# EAGLE design GBP USB-C Charging Kit Pro (EAGLE 6.2)
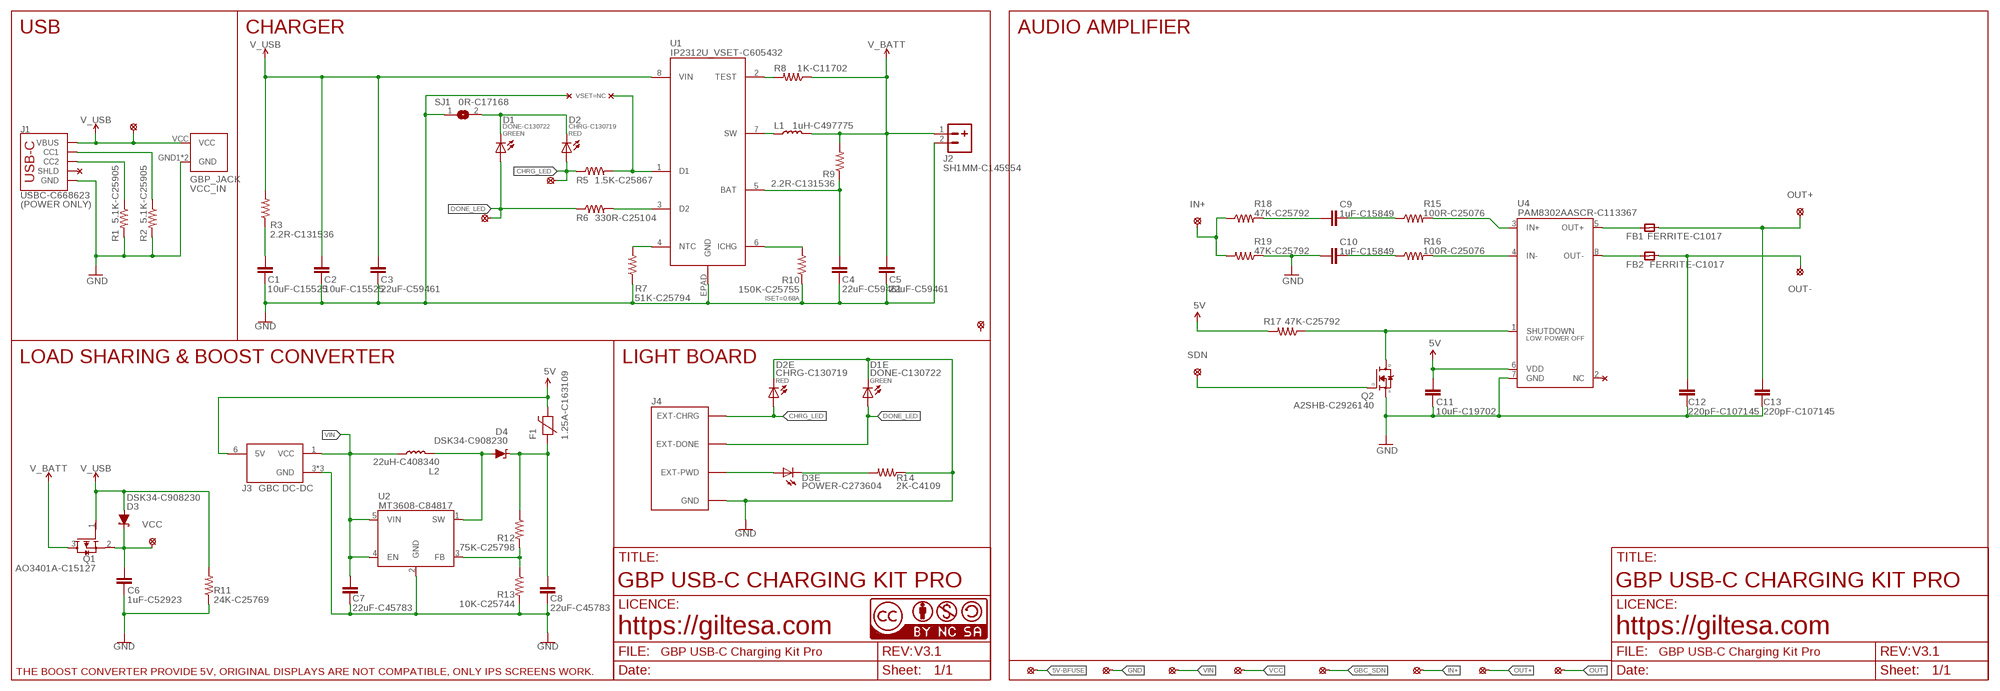
[diagram p0: schematic, sheet 1]

## Parts
C1  10uF-C15525  C0402_S  [C0402_S]
C2  10uF-C15525  C0402_S  [C0402_S]
C3  22uF-C59461  C0603_SMALL  [C0603_S]
C4  22uF-C59461  C0603_SMALL  [C0603_S]
C5  22uF-C59461  C0603_SMALL  [C0603_S]
C6  1uF-C52923  C0402_S  [C0402_S]
C7  22uF-C45783  C0805_SMALL  [C0805_S]
C8  22uF-C45783  C0805_SMALL  [C0805_S]
C9  1uF-C15849  C0603_SMALL  [C0603_S]
C10  1uF-C15849  C0603_SMALL  [C0603_S]
C11  10uF-C19702  C0603_SMALL  [C0603_S]
C12  220pF-C107145  C0805_SMALL  [C0805_S]
C13  220pF-C107145  C0805_SMALL  [C0805_S]
D1  DONE-C130722  LED_0402  [L0402]
D1E  DONE-C130722  LED_0402  [L0402]
D2  CHRG-C130719  LED_0402  [L0402]
D2E  CHRG-C130719  LED_0402  [L0402]
D3  DSK34-C908230  DIODE-SCHOTTKY_SOD-123FL  [SOD-123FL]
D3E  POWER-C273604  LED_0402  [L0402]
D4  DSK34-C908230  DIODE-SCHOTTKY_SOD-123FL  [SOD-123FL]
F1  1.25A-C163109  FUSE0603_S  [F0603_S]
FB1  FERRITE-C1017  MICROBUILDER_FERRITE_SMALL  [MICROBUILDER__0805MP_S]
FB2  FERRITE-C1017  MICROBUILDER_FERRITE_SMALL  [MICROBUILDER__0805MP_S]
GBP_JACK  VCC_IN  GBP_POWER_JACK_DIP  [GBP_POWER_JACK_DIP]
J1  USBC-C668623  USB-C_6P_POWER  [USB-C_6P]
J2  SH1MM-C145954  JST-21MM  [JST-2-1MM-SMD_RIGHT]
J3  GBC DC-DC  GBP_DC_DC_V2  [GBP_DC_DC_DIP_V2]
J4  GBP_LED_V2  [GBP_LED_V2]
L1  1uH-C497775  INDUCTOR_2  [PSPMAA0402]
L2  22uH-C408340  INDUCTOR_2  [PSPMAA0402]
PP1  SOLDER_PAD-1.5  [SOLDER_PAD_1.5]
PP2  SOLDER_PAD-1.5  [SOLDER_PAD_1.5]
PP3  SOLDER_PAD-1.5  [SOLDER_PAD_1.5]
PP4  SOLDER_PAD-1.5  [SOLDER_PAD_1.5]
PP5  SOLDER_PAD-1.5  [SOLDER_PAD_1.5]
PP6  SOLDER_PAD-1.5  [SOLDER_PAD_1.5]
PP7  SOLDER_PAD-1.5  [SOLDER_PAD_1.5]
PP8  SOLDER_PAD-1.5  [SOLDER_PAD_1.5]
Q1  AO3401A-C15127  AO3401A_SMALL  [SOT23-3_S]
Q2  A2SHB-C2926140  MOSFET-NCHANNEL_SMALL  [SOT23-3_S]
R1  5.1K-C25905  R0402  [R0402]
R2  5.1K-C25905  R0402  [R0402]
R3  2.2R-C131536  R0402  [R0402]
R5  1.5K-C25867  R0402  [R0402]
R6  330R-C25104  R0402  [R0402]
R7  51K-C25794  R0402  [R0402]
R8  1K-C11702  R0402  [R0402]
R9  2.2R-C131536  R0402  [R0402]
R10  150K-C25755  R0402  [R0402]
R11  24K-C25769  R0402  [R0402]
R12  75K-C25798  R0402  [R0402]
R13  10K-C25744  R0402  [R0402]
R14  2K-C4109  R0402  [R0402]
R15  100R-C25076  R0402  [R0402]
R16  100R-C25076  R0402  [R0402]
R17  47K-C25792  R0402  [R0402]
R18  47K-C25792  R0402  [R0402]
R19  47K-C25792  R0402  [R0402]
SJ1  0R-C17168  JUMPER-SMD0402  [JUMPER-SMD_0402]
U1  IP2312U_VSET-C605432  IP2312_CUSTOM  [IP2312]
U2  MT3608-C84817  MT3608"  [SOT-23-6]
U4  PAM8302AASCR-C113367  PAM8302A_ASCR  [PAM8302AASCR]
U$1  VCC  PAD_1.4  [PAD_1.4]
U$2  SDN  PAD_1.25  [PAD_1.25]
U$6  CC-BY-NC-SA15MM  [CC-BY-NC-SA_15MM]
U$20  OUT+  SOLDER_PAD-2.0  [SOLDER_PAD_2.0]
U$23  OUT-  SOLDER_PAD-2.0  [SOLDER_PAD_2.0]
U$24  CHRG_LED  SOLDER_PAD-1.3  [SOLDER_PAD_1.3]
U$25  DONE_LED  SOLDER_PAD-1.3  [SOLDER_PAD_1.3]
U$30  IN+  SOLDER_PAD-1.3  [SOLDER_PAD_1.3]
U$54  PAD_1.4  [PAD_1.4]
U$55  SOLDER_PAD-2.0  [SOLDER_PAD_2.0]

## Nets
5V: C11.1 F1.2 J3.6(5V) R17.2 U4.6(VDD)
5V-BFUSE: C8.2 D4.C F1.1 PP1.P$1 R12.1
CHRG_LED: D2.A D2E.A J4.EXT-CHRG R5.1 U$24.P$1
DONE_LED: D1.A D1E.A J4.EXT-DONE R6.1 U$25.P$1
GBC_SDN: PP5.P$1 Q2.1(G) U$2.P$1
GND: C1.1 C2.1 C3.1 C4.1 C5.1 C6.2 C7.1 C8.1 C10.2 C11.2 C12.2 C13.2 D1E.C D2E.C GBP_JACK.GND1(GND) GBP_JACK.GND2(GND) J1.A12-GND(GND) J1.B12-GND(GND) J2.2 J3.3(GND) J3.3_1(GND) J3.3_2(GND) J4.GND PP2.P$1 Q2.2(S) R1.2 R2.2 R7.1 R10.1 R11.1 R13.2 R14.1 R19.1 SJ1.1 U1.EPAD(GND) U2.2(GND) U4.7(GND)
IN+: PP6.P$1 R18.1 R19.2 U$30.P$1
N$1: D1.C D2.C SJ1.2
N$3: D4.A L2.P$2 U2.1(SW)
N$4: J1.B5(CC2) R1.1
N$6: R8.2 U1.2(TEST)
N$7: R12.2 R13.1 U2.3(FB)
N$9: R16.2 U4.4(IN-)
N$10: D3E.A J4.EXT-PWD J4.EXT-PWD'(EXT-PWD)
N$11: D3E.C R14.2
N$12: R15.2 U4.3(IN+)
N$13: J1.A5(CC1) R2.1
N$14: C4.2 R9.1 U1.5(BAT)
N$15: C1.2 R3.1
N$16: C10.1 R16.1
N$17: FB2.1 U4.8(OUT-)
N$19: R5.2 U1.1(D1)
N$22: FB1.1 U4.5(OUT+)
N$23: C9.1 R15.1
N$25: C9.2 R18.2
N$27: R7.2 U1.4(NTC)
N$28: R10.2 U1.6(ICHG)
N$29: R6.2 U1.3(D2)
N$31: L1.P$1 U1.7(SW)
OUT+: C13.1 FB1.2 PP7.P$1 U$20.P$1
OUT-: C12.1 FB2.2 PP8.P$1 U$23.P$1
SDN: Q2.3(D) R17.1 U4.1(SHUTDOWN)
V_BATT: C5.2 J2.1 L1.P$2 Q1.3(D) R8.1 R9.2
V_USB: C2.2 C3.2 D3.A GBP_JACK.VCC J1.A9-VBUS(VBUS) J1.B9-VBUS(VBUS) Q1.1(G) R3.2 R11.2 U1.8(VIN) U$54.P$1
VCC: C6.1 D3.C PP4.P$1 Q1.2(S) U$1.P$1
VIN: C7.2 J3.1(VCC) L2.P$1 PP3.P$1 U2.4(EN) U2.5(VIN)
Unconnected: J1.SHLD1(SHLD) J1.SHLD2(SHLD) J1.SHLD3(SHLD) J1.SHLD4(SHLD) U4.2(NC) U$55.P$1

## Notes on the sheet
- USB | CHARGER | AUDIO AMPLIFIER
- VSET=NC
- GREEN | RED
- (POWER ONLY)
- ISET=0.68A
- LOAD SHARING & BOOST CONVERTER | LIGHT BOARD
- RED | GREEN
- GBP USB-C CHARGING KIT PRO | GBP USB-C CHARGING KIT PRO
- https://giltesa.com | https://giltesa.com
- V3.1 | V3.1
- THE BOOST CONVERTER PROVIDE 5V, ORIGINAL DISPLAYS ARE NOT COMPATIBLE, ONLY IPS SCREENS WORK.

## Library data of the parts
C1 C2 C6 = ,giltesa:C0402
C3-C5 C9-C11 = ,giltesa:C0603
C7 C8 C12 C13 = ,giltesa:C0805
D1 D1E D2 D2E D3E = ,giltesa:LED
D3 D4 = ,giltesa:DIODE-SCHOTTKY
F1 = ,giltesa:FUSE
FB1 FB2 = microbuilder:MICROBUILDER_FERRITE: Ferrite Bead 0603 MMZ1608B121C - 120 Ohm @ 100MHz, 600mA, 0.15 Ohm DC Resistance - Digikey: 445-2164-1-ND BK1608HW121-T - 120 Ohm, 600mA Ferrite Chip - Digikey: 587-1876-2-ND 0805 HZ0805B272R-10 - 2.7K Ohm @ 100MHz, 200mA, 0.8 Ohm DC Resistance - Digikey: 240-2504-1-ND (see also Murata BLM21BD272SN1L) MMZ2012Y152B - 1.5K Ohm @ 100MHz, 500mA, 0.4 Ohm DC Resistance - Digikey: 445-1560-1-ND - Mainly for high frequency (80-400MHz) MMZ2012R102A - 1K Ohm @ 100MHz, 500mA, 0.3 Ohm DC Resistance - Digikey: 445-1555-2-ND - More general purpose (10-200MHz)
GBP_JACK = ,giltesa:GBP_POWER_JACK
J1 = ,giltesa:USB-C_6P
J2 = ,giltesa:JST-2
J3 = ,giltesa:GBP_DC_DC
J4 = ,giltesa:GBP_LED_V2
L1 L2 = ,giltesa:INDUCTOR
PP1-PP8 U$20 U$23-U$25 U$30 U$55 = ,giltesa:SOLDER_PAD
Q1 = ,giltesa:AO3401A
Q2 = ,giltesa:MOSFET-NCHANNEL
R1-R3 R5-R19 = ,giltesa:R0402
SJ1 = ,giltesa:JUMPER-SMD
U1 = ,giltesa:IP2312
U2 = ,giltesa:MT3608
U4 = ,giltesa:PAM8302A
U$1 U$2 U$54 = ,giltesa:PAD
U$6 = ,giltesa_logos:CC-BY-NC-SA

## Net classes
1 power: width 0.61 mm, drill 0.406 mm, clearance 0.203 mm
2 gnd: width 0.305 mm, drill 0.406 mm, clearance 0.203 mm
3 power usb: width 0.508 mm, drill 0.406 mm, clearance 0.203 mm

## Board
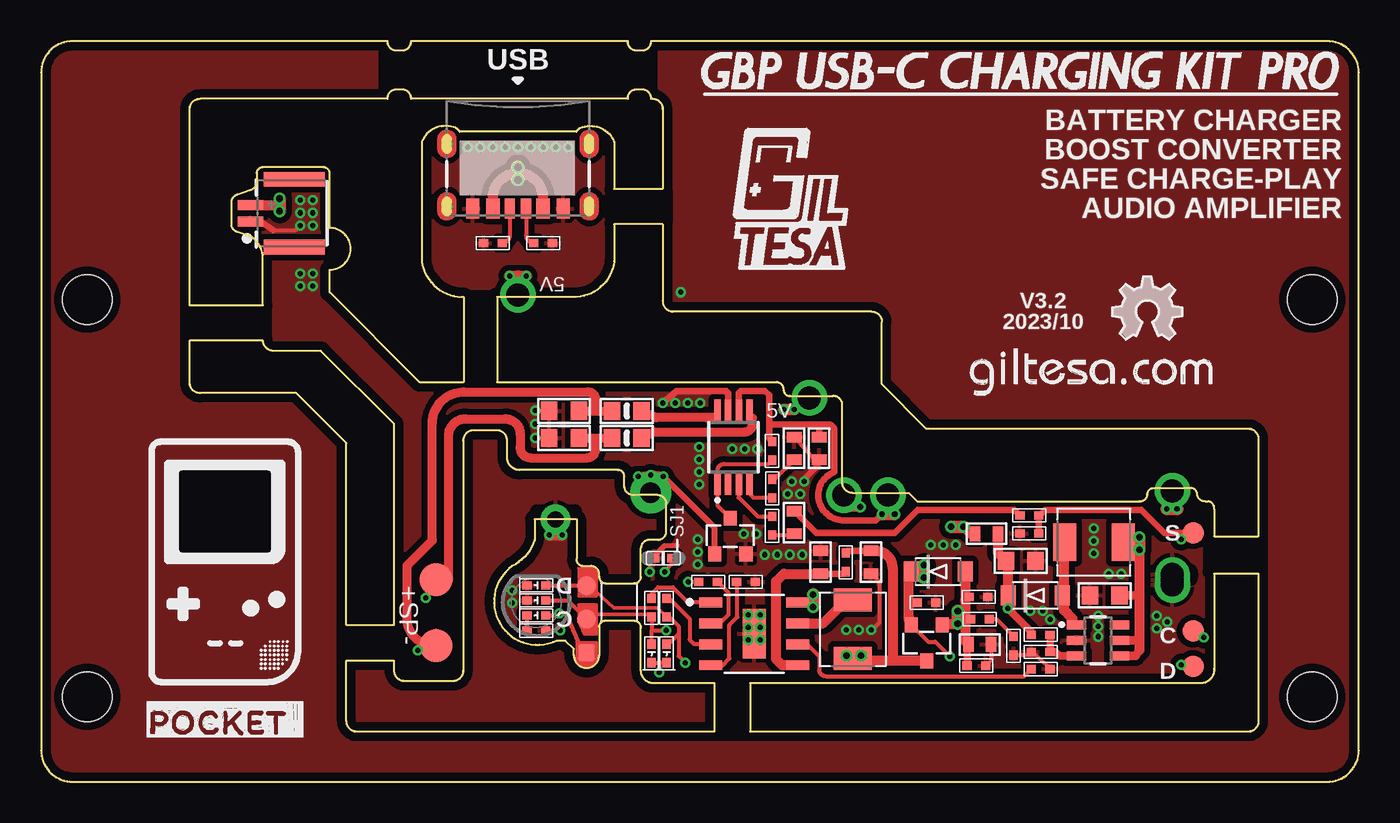
[diagram p1: board, top side]
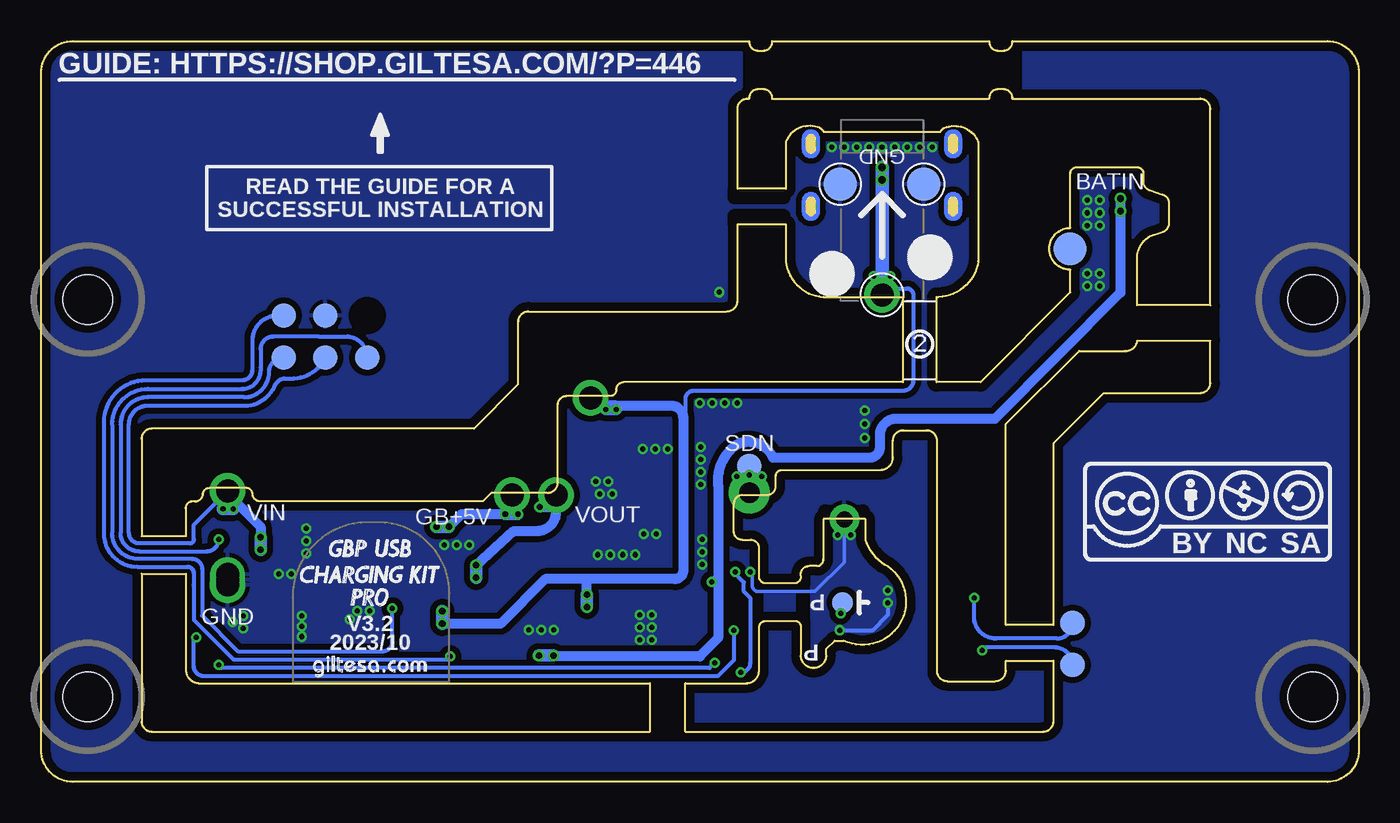
[diagram p2: board, bottom side, seen from below]

Size 80 x 45 mm. Coordinates in mm from the lower left corner, seen from the top.
Outline: 16.99,26.18 14.19,26.18 arc-90 13.46,26.79 9.01,26.79 9.01,24.25 arc90 9.64,23.62 15.49,23.62 18.54,20.57 18.54,9.52 21.43,9.52 21.43,21.74 16.99,26.18
Outline: 22.95,24.28 17.52,29.74 17.52,31.11 arc180 17.52,33.65 17.52,36.95 arc90 17.14,37.33 13.46,37.33 arc90 13.07,36.95 13.07,36.32 arc-50 12.69,35.94 11.93,35.68 arc60 11.55,35.3 11.55,33.78 arc60 11.93,33.4 12.69,33.14 arc-50 13.46,32 13.46,28.95 9.01,28.95 9.01,40.86 arc-90 9.64,41.5 21.03,41.5 arc-90 21.55,42.08 21.93,42.08 arc-90 22.44,41.5 35.62,41.5 arc-90 36.12,42.08 36.51,42.08 arc-90 37.01,41.5 37.13,41.5 arc-90 37.74,40.86 37.74,36.03 34.79,36.03 34.79,38.89 arc90 32.74,39.73 arc40 32.49,39.49 25.4,39.49 arc40 25.16,39.73 arc90 23.11,38.89 23.11,31.61 arc80 25.52,29.46 25.65,29.46 25.65,24.28 22.95,24.28
Outline: 53.18,17.04 66.66,17.04 arc90 67.17,17.47 arc-90 67.55,17.85 69.8,17.85 arc-90 70.18,17.47 arc90 70.69,17.04 70.85,17.04 arc-90 71.22,16.58 71.22,14.92 73.91,14.92 73.91,20.82 arc90 73.27,21.46 53.71,21.46 51.05,24.15 51.05,27.94 arc90 50.41,28.57 38.37,28.57 arc-90 37.74,29.21 37.74,33.88 34.79,33.88 34.79,31.61 arc-80 32.51,29.46 27.68,29.46 27.68,24.28 44.66,24.28 arc-90 45.08,23.8 arc90 45.45,23.44 48.08,23.44 arc-90 48.63,22.93 48.63,18.18 arc90 49.27,17.55 52.67,17.55 53.18,17.04
Outline: 71.22,12.63 71.22,6.88 arc-90 70.45,5.99 43.05,5.99 43.05,3.04 73.27,3.04 arc90 73.91,3.68 73.91,12.63 71.22,12.63
Outline: 40.89,5.99 37.18,5.99 arc-90 36.42,6.75 36.42,9.34 arc90 36.04,9.77 34.2,9.77 arc90 33.88,9.39 33.88,7.69 arc-180 32.34,7.69 32.34,8.07 31.83,8.57 31.27,8.57 arc-170 28.6,13.1 arc45 29.96,14.7 29.96,15.97 32.51,15.97 32.51,13.55 arc90 32.89,13.1 33.37,13.1 arc-90 33.88,12.66 33.88,12.51 arc90 34.25,12.05 35.98,12.05 arc90 36.42,12.45 36.42,14.19 arc-90 36.92,14.7 37.43,14.7 arc90 37.94,15.16 37.94,16.91 arc90 37.43,17.42 35.99,17.42 arc-90 35.4,17.93 35.4,18.56 arc90 35.02,18.94 29.05,18.94 arc-90 28.29,19.71 28.29,20.72 arc90 27.65,21.36 26.26,21.36 arc90 25.62,20.72 25.62,6.75 arc-90 24.99,6.12 22.07,6.12 arc-90 21.43,6.75 21.43,7.36 18.54,7.36 18.54,3.68 arc90 19.17,3.04 40.89,3.04 40.89,5.99
Outline: 1.91,0 78.07,0 arc90 80,1.91 80,43.1 arc90 78.07,45 37.01,45 arc-90 36.51,44.42 36.12,44.42 arc-90 35.62,45 22.44,45 arc-90 21.93,44.42 21.55,44.42 arc-90 21.03,45 1.91,45 arc90 0,43.1 0,1.91 arc90 1.91,0
Copper layers (1*16): Top 0.035mm / dielectric 1.6mm / Bottom 0.035mm
Design rules: minimum track width 6mil, minimum drill 12mil, track to track 6mil, track to pad 6mil, pad to pad 6mil, via to via 8mil, smd to smd 0mil, copper to edge 20mil, drill to drill 10mil, minimum pad ring 6mil, minimum via ring 6mil, stop-mask expansion 0mil, vias tented up to drill 100mil, thermal gap 10mil
Holes 3 mm at 77.17,29.29 2.8,29.29 2.8,5.16 77.17,5.16
tRestrict: area 8.6,14.1 to 13.7,18.7; 19 lines
bRestrict: area 59.6,27.7 to 60.8,29; 21 lines

### Footprints (pad centres in the part's own frame; a part is rotated, then mirrored left to right if it is on the bottom)
C0402_S = smd 0.559 x 0.5: 1 -0.567,0; 2 0.567,0
C0603_S = smd 0.635 x 0.9: 1 -0.694,0; 2 0.694,0
C0805_S = smd 1 x 1.1: 1 -0.901,0; 2 0.901,0
L0402 = smd 0.559 x 0.5: A 0.567,0; C -0.567,0
SOD-123FL = smd 0.91 x 1.22: A 1.637,0; C -1.637,0
F0603_S = smd 0.635 x 0.9: 1 -0.694,0; 2 0.694,0
MICROBUILDER__0805MP_S = smd 1 x 1.1: 1 -0.901,0; 2 0.901,0
GBP_POWER_JACK_DIP = smd 2.032 x 2.032 bottom: GND1 -2.54,1.905; GND2 2.54,1.905 | drill 1.397 pad 2.159: VCC 0,8.636
USB-C_6P = smd 0.635 x 1.2: A5 -0.5,2.034; B5 0.5,2.034 | smd 0.8 x 1.2: A9-VBUS 1.52,2.034; A12-GND 2.75,2.034; B9-VBUS -1.52,2.034; B12-GND -2.75,2.034 | drill 0.4 pad 0.6: SHLD1 -4.318,1.9; SHLD2 4.32,1.9; SHLD3 -4.318,-1.9; SHLD4 4.32,-1.9
JST-2-1MM-SMD_RIGHT = smd 0.6 x 1.524: 1 -0.5,-2.017; 2 0.5,-2.017 | smd 0.889 x 3.683: NC1 -2.054,0.635; NC2 2.054,0.635
GBP_DC_DC_DIP_V2 = drill 1.397 pad 2.159: 1 17.272,5.334; 3 17.272,-0.381; 6 0,5.08 | drill 1.397 pad 2.032: 3_1 17.272,-0.064; 3_2 17.272,0.254
GBP_LED_V2 = smd 1.143 x 1.143: EXT-CHRG -3.048,1.016; EXT-DONE -3.048,-1.016 | smd 1.27 x 1.27 bottom: EXT-PWD -1.27,0 | smd 1.016 x 1.016: EXT-PWD' -3.048,3.048 | drill 1 pad 1.8: GND -1.166,-5.048
PSPMAA0402 = smd 1.4 x 2.3: P$1 -1.775,0; P$2 1.775,0
SOLDER_PAD_1.5 = smd 1.5 x 1.5: P$1 0,0
SOT23-3_S = smd 0.8 x 0.9: 1 -0.95,-1.076; 2 0.95,-1.076; 3 0,1.1
R0402 = smd 0.559 x 0.5: 1 -0.567,0; 2 0.567,0
JUMPER-SMD_0402 = smd 0.635 x 0.5: 1 -0.559,0; 2 0.559,0
IP2312 = smd 1.4 x 0.6: 1 -2.65,1.905; 2 -2.65,0.635; 3 -2.65,-0.635; 4 -2.65,-1.905; 5 2.65,-1.905; 6 2.65,-0.635; 7 2.65,0.635; 8 2.65,1.905 | smd 1.4 x 3: EPAD 0,0
SOT-23-6 = smd 0.55 x 1.2: 1 -0.95,-1.3; 2 0,-1.3; 3 0.95,-1.3; 4 0.95,1.3; 5 0,1.3; 6 -0.95,1.3
PAM8302AASCR = smd 0.4 x 1.4: 1 -0.975,-2.2; 2 -0.325,-2.2; 3 0.325,-2.2; 4 0.975,-2.2; 5 0.975,2.2; 6 0.325,2.2; 7 -0.325,2.2; 8 -0.975,2.2
PAD_1.4 = drill 1.397 pad 2.159: P$1 0,0
PAD_1.25 = drill 1.25 pad 2.5: P$1 0,0
SOLDER_PAD_2.0 = smd 2 x 2: P$1 0,0
SOLDER_PAD_1.3 = smd 1.3 x 1.3: P$1 0,0

### Placement (x,y rotation side)
C1  59.03,8.27 90 top
C2  56.78,7.05 180 top
C3  56.99,8.35 180 top
C4  47.32,13.33 270 top
C5  50.38,13.33 90 top
C6  53.75,10.89 0 top
C7  64.58,11.32 0 top
C8  59.48,13.42 180 top
C9  45.71,15.76 90 top
C10  45.71,20.25 90 top
C11  47.24,20.25 270 top
C12  31.74,22.54 180 top
C13  31.74,20.89 180 top
D1  37.97,7.8 90 top
D1E  30.07,11.93 0 top
D2  37.06,7.8 90 top
D2E  30.07,11.02 0 top
D3  54.46,12.77 0 top
D3E  30.07,10.1 0 top
D4  60.36,11.32 0 top
F1  57.4,15.07 180 top
FB1  35.55,20.89 180 top
FB2  35.55,22.54 180 top
GBP_JACK  28.95,38.22 180 top
J1  28.95,36.86 180 top
J2  14.73,34.54 270 top
J3  51.4,12.34 0 top
J4  30.07,10.89 180 top
L1  49.28,9.26 270 top
L2  63.91,14.56 180 top
LOGO1  OSHW_LOGO_FILLX0150-NT  [OSHW_FILLX150_NOTEXT]  65.03,26.87 0 top
PP1  60.2,25.78 0 bottom
PP2  62.74,28.32 0 bottom
PP3  62.74,25.78 0 bottom
PP4  65.28,28.32 0 bottom
PP5  37,19.17 0 bottom
PP6  65.28,25.78 0 bottom
PP7  17.38,9.64 0 bottom
PP8  17.38,7.1 0 bottom
Q1  53.77,8.45 180 top
Q2  41.84,14.92 0 top
R1  27.43,32.73 180 top
R2  30.47,32.73 0 top
R3  56.99,9.89 180 top
R5  37.06,10.58 90 top
R6  37.97,10.58 90 top
R7  42.78,12.14 180 top
R8  40.5,12.14 0 top
R9  48.85,13.33 90 top
R10  60.68,6.85 180 top
R11  56.91,11.23 180 top
R12  60.68,8.93 0 top
R13  60.68,7.89 180 top
R14  30.07,9.19 180 top
R15  44.38,15.56 90 top
R16  44.38,17.82 270 top
R17  44.38,20.1 90 top
R18  59.99,16.18 180 top
R19  59.99,15.09 0 top
SJ1  37.77,13.58 0 top
U1  43.29,8.99 0 top
U2  64.16,8.59 270 top
U4  42.03,20.34 0 top
U$1  48.74,17.42 0 top
U$2  37,17.56 0 top
U$3  [GILTESA_LOGO_MASK_9MM]  41.15,30.99 0 top
U$4  [GBP_PRO_FRAME]  40.13,42.04 0 top
U$6  16.74,13.36 0 bottom
U$7  GILTESA.COM_MASK  [GILTESA.COM_MASK]  56.27,23.38 0 top
U$20  23.97,12.28 0 top
U$23  23.97,8.28 0 top
U$24  69.94,9.16 0 top
U$25  69.94,7 0 top
U$30  69.94,15.13 0 top
U$31  [GBP_FRAME_LOGO]  6.42,2.68 0 top
U$34  [GAME_BOY_POCKET_USB_CHARGING_KIT_PRO]  64.29,10.62 0 bottom
U$52  [GILTESA.COM_MASK_7MM]  63.53,6.3 0 bottom
U$54  46.64,23.33 0 top
U$55  17.53,32.38 0 bottom
U$61  [SCISSOR_TWO]  26.66,26.6 0 bottom

### Tracks (layer width: path | path; a pad name or v marks a point on that pad's centre or on a via)
5V  (via drill 0.36, 0.41)
  Top 0.406: U4.6 42.36,23.63 42.48,23.75 43.94,23.75 44.2,23.48 44.2,21.72 | C11.1 47.25,20.83 47.25,21.72 | v51.05,16.26 50.67,15.88 48.77,15.88 arc-90 47.18,17.4 arc-70 48.16,18.82 48.16,21.31 arc90 47.75,21.72 47.25,21.72 | v51.82,16.26 51.4,16.26 J3.6 | 47.25,21.72 44.2,21.72 | R17.2 44.2,20.86 44.2,21.72
  Top 0.61: F1.2 56.43,15.07 v56.01,15.49
  Top 0.711: v51.05,16.26 v51.82,16.26
  Top 0.762: v56.01,15.49 v55.24,15.49
  Bottom 0.61: v51.82,16.26 54.48,16.26 v55.24,15.49
  Bottom 0.711: v51.82,16.26 v51.05,16.26
  Bottom 0.762: v55.24,15.49 v56.01,15.49
5V-BFUSE  (via drill 0.3)
  Top 0.254: 60.07,8.93 R12.1
  Top 0.457: R12.1 60.12,9.1 58.93,10.29 | D4.C 58.79,11.19 58.93,11.05 58.93,10.29 | 58.93,10.29 v58.67,10.54
  Top 0.61: D4.C 58.72,13.27 C8.2 58.09,13.9 F1.1
  Bottom 0.254: PP1.P$1 PP1.P$1 arc-90 61.46,27.04 63.11,27.04 arc90 63.11,27.05 65.92,27.05 arc-90 66.67,26.29 66.67,25.15 66.67,25.02 arc90 67.81,23.87 73.53,23.87 arc-90 75.69,21.71 75.69,15.11 arc-90 74.15,13.55 70.85,13.55 arc90 70.23,12.95 70.23,10.1 68.07,7.94 59.24,7.94 arc-90 58.67,8.51 v58.67,10.54
CHRG_LED  (via drill 0.3)
  Top 0.203: R5.1 36.95,10.16 33.4,10.16 J4.EXT-CHRG
  Top 0.254: D2E.A 31.97,11.02 J4.EXT-CHRG 33.37,9.88 | D2.A 37.06,9.19 | 37.06,9.19 v37.95,9.19 | R5.1 37.06,9.19 | v70.6,8.78 U$24.P$1
  Bottom 0.254: v37.95,9.19 37.95,7.39 38.92,6.41 70.1,6.41 arc90 70.74,7.05 70.74,8.64 arc90 v70.6,8.78
DONE_LED  (via drill 0.3)
  Top 0.203: R6.1 37.4,10.58 34.77,10.58 33.37,11.85 J4.EXT-DONE
  Top 0.254: D1E.A 33.09,11.93 J4.EXT-DONE 33.12,11.72 | D1.A 38.09,8.37 38.71,8.99 | R6.1 38.15,10.01 38.71,9.45 38.71,8.99 | 38.71,8.99 38.71,7.64 v39.12,7.24 | v69.22,7.11 69.83,7.11 U$25.P$1
  Bottom 0.254: v39.12,7.24 39.43,6.92 69.09,6.92 69.22,7.05 v69.22,7.11
GBC_SDN  (via drill 0.3)
  Top 0.356: Q2.1 40.89,15.41 v37.77,18.54
  Top 0.559: v36.24,18.54 v37,18.64 | v37.77,18.54 v37,18.64 | v37,18.64 U$2.P$1
  Bottom 0.559: PP5.P$1 U$2.P$1
GND  (via drill 0.3)
  Top 0.203: v36.96,12.76 36.96,13.33 SJ1.1
  Top 0.254: R14.1 31.49,9.19 v31.51,9.21 | C11.2 47.1,19.43 C10.2 | v50.39,9.24 50.46,9.24 50.9,9.68 50.9,12.12 C5.1 | C1.1 60.07,7.7 | 60.07,7.7 60.4,7.7 R10.1 | R13.2 60.12,7.75 60.07,7.7 | J2.2 13.33,34.04 | 14.1,33.53 15.45,33.53 v15.73,33.8 | C3.1 57.68,7.38 C2.1
  Top 0.305: SJ1.1 37.21,13.71 37.85,14.35 38.61,14.35
  Top 0.406: U4.7 41.71,23.62 41.59,23.75 38.6,23.75 v37.74,23.01 | 47.1,19.43 47.1,19.16 46.48,18.54 | 13.33,34.04 14.1,33.53
  Top 0.66: v30.86,14.99 v31.62,14.99
  Bottom 0.203: 31.24,15.93 31.24,13.34 33.02,11.56 36.45,11.56 arc90 36.83,11.94 36.83,12.7 v36.96,12.76
  Bottom 0.254: v31.51,9.21 29.52,9.21 28.59,10.14 v28.59,10.87 | 31.24,15.93 J4.GND
  other vias: 38.84,29.74 28.95,38.56 28.19,38.56 27.43,38.56 26.66,38.56 29.71,38.56 30.47,38.56 31.24,38.56 25.9,38.56 32,38.56 29.99,22.55 29.99,21.72 29.99,20.9 28.59,11.63 15.73,35.33 16.49,35.33 16.49,34.56 15.73,34.56 16.49,33.8 38.5,23.01 39.26,23.01 40.02,23.01 39.85,13.2 39.95,18.05 39.95,18.82 39.95,19.58 39.95,20.34 43.48,20.21 42.72,20.21 41.96,20.21 39.85,13.96 39.85,14.73 42.93,10.15 43.66,10.15 48.87,9.24 49.63,9.24 45.33,17.48 45.58,18.24 46.09,17.48 46.34,18.24 46.22,13.8 45.45,13.8 44.69,13.8 43.93,13.8 43.42,15.07 42.66,15.07 63.92,15.4 60.05,10.38 60.81,10.38 61.25,9.87 63.92,14.64 63.92,13.88 65.57,12.63 64.81,12.63 64.17,10.09 64.17,8.82 64.17,9.46 67.73,10.09 67.73,9.33 68.36,9.71 42.93,9.39 42.93,8.63 43.66,9.39 43.66,8.63 55.54,14.38 54.77,14.38 54.01,14.38 16.49,30.88 15.73,30.88 15.73,30.12 16.49,30.12
  pour Top (isolate 0.356): -2,47 81.97,47 81.97,-2 -2,-2
  pour Bottom (isolate 0.356): -2,47 81.97,47 81.97,-2 -2,-2
IN+  (via drill 0.3)
  Top 0.254: v69.22,14.73 69.22,15 69.09,15.13
  Top 0.406: U$30.P$1 69.09,15.13 68.18,15.13 66.8,16.51 60.96,16.51 60.63,16.18 R18.1 R19.2
  Bottom 0.254: 66.16,24.89 66.16,24.9 | 66.16,24.9 arc90 PP6.P$1 | 66.16,24.9 arc90 67.69,23.36 73.53,23.36 arc-90 75.18,21.71 75.18,15.11 arc-90 74.07,14 69.94,14 arc-90 v69.22,14.73
N$1  (via drill 0.3)
  Top 0.254: D1.C 37.51,7.24 | D2.C 37.51,7.24 | 37.51,7.24 v37.51,6.66 | SJ1.2 38.33,13.31 v37.85,12.76
  Bottom 0.254: v37.85,12.76 37.85,12.64 37.34,12.13 37.34,11.56 36.96,11.18 36.96,7.21 arc90 v37.51,6.66
N$3
  Top 0.508: U2.1 62.85,9.54 62.61,9.78
  Top 0.61: 62.61,9.78 62.61,9.91 62.1,10.41 62.1,11.3 | 62.1,11.3 62.1,14.53 L2.P$2 | D4.A 62.09,11.32 62.1,11.3
N$4
  Top 0.254: J1.B5 28.45,33.19 arc-90 R1.1
N$6
  Top 0.254: U1.2 41.2,9.63 41.73,10.16 41.73,11.48 R8.2
N$7
  Top 0.457: R12.2 R13.1 61.58,7.89 61.83,7.64 U2.3
N$9
  Top 0.254: U4.4 43.01,17.5 43.24,17.27 44.36,17.27 R16.2
N$10  (via drill 0.3)
  Top 0.254: D3E.A 31.34,10.11 v31.46,10.23 31.8,10.23 31.88,10.16 32.77,8.13 J4.EXT-PWD'
  Bottom 0.254: J4.EXT-PWD v31.46,10.23
N$11
  Top 0.254: R14.2 D3E.C
N$12
  Top 0.254: U4.3 42.35,17.88 42.35,17.27 43.49,16.12 R15.2
N$13
  Top 0.254: J1.A5 29.45,33.19 arc90 R2.1
N$14
  Top 0.406: 47.37,12.64 48.72,12.64 R9.1
  Top 0.61: U1.5 44.98,7.09 44.63,7.44 44.63,12.18 45.09,12.64 47.37,12.64 arc90 47.37,12.64 C4.2
N$15
  Top 0.254: R3.1 57.98,9.89 C1.2
N$16
  Top 0.254: R16.1 44.54,18.39 C10.1
N$17
  Top 0.254: U4.8 41.06,22.12 40.39,22.12
  Top 0.559: 40.83,22.12 40.39,22.12 37.33,22.12 FB2.1
N$19
  Top 0.254: R5.2 37.06,11.4 37.47,11.81 38.35,11.81 39.27,10.9 U1.1
N$22
  Top 0.254: 43.18,22.1 43.01,22.1 U4.5
  Top 0.559: FB1.1 37.2,21.25 42.72,21.25 arc90 43.18,21.72 43.18,22.1
N$23
  Top 0.254: R15.1 45.64,14.99 C9.1
N$25
  Top 0.406: C9.2 47.05,15.11 51.82,15.11 53.21,16.51 59.09,16.51 R18.2
N$27
  Top 0.254: U1.4 41.38,7.09 41.78,7.49 41.78,9.53 42.27,10.01 42.27,12.07 R7.2
N$28
  Top 0.254: U1.6 46.51,8.36 47.24,7.62 47.24,6.79 arc90 47.62,6.41 59.68,6.41 R10.2
N$29
  Top 0.254: R6.2 38.13,11.15 39.37,9.91 39.37,8.64 39.62,8.38 40.62,8.38 U1.3
N$31
  Top 0.61: U1.7 47.47,9.63 48.5,10.66 L1.P$1
OUT+  (via drill 0.3)
  Top 0.254: U$20.P$1 23.97,11.78 v23.36,11.17
  Top 0.559: 24.73,12.28 24.73,12.45 | 24.73,12.45 24.73,21.01 arc-90 25.77,22.05 28.16,22.05 arc-90 29.08,21.14 29.08,20.32 arc90 29.71,19.68 33.14,19.68 arc90 33.66,20.19 33.66,20.89 | U$20.P$1 24.56,12.28 24.73,12.45 | C13.1 33.66,20.89 | 33.66,20.89 FB1.2
  Bottom 0.254: 17.38,9.54 PP7.P$1 arc90 18.32,8.71 22.04,8.71 arc90 23.36,10.03 v23.36,11.17
OUT-  (via drill 0.3)
  Top 0.254: 23.86,8.28 23.13,8.28 v22.85,8
  Top 0.559: U$23.P$1 23.86,8.28 23.84,8.28 arc-90 22.22,9.9 22.22,13.15 23.75,14.68 23.75,21.78 arc-90 25.65,23.68 33.22,23.68 arc-90 33.66,23.24 33.66,22.54 | C12.1 33.66,22.54 | 33.66,22.54 FB2.2 arc-90 FB2.2
  Bottom 0.254: 17.52,7.1 PP8.P$1 arc-90 18.45,8.17 22.68,8.17 v22.85,8
SDN
  Top 0.254: Q2.3 41.06,16.8 U4.1 41.06,18.9 arc-90 41.46,19.3 44.14,19.3 R17.1
V_BATT  (via drill 0.3, 0.41)
  Top 0.254: R8.1 v39.29,12.14
  Top 0.406: C5.2 48.98,14.03 R9.2
  Top 0.599: J2.1 14.24,35.04
  Top 0.61: 14.24,35.04 v14.48,34.67 | 51.69,7.35 49.54,7.35 L1.P$2 | 51.69,7.35 51.69,13.01 arc90 50.67,14.03 C5.2 | Q1.3 51.69,7.35
  Top 0.762: v14.48,35.43 v14.48,34.67 | v49.78,7.67 v48.9,7.67 49.28,7.67 L1.P$2
  Bottom 0.254: v39.29,12.14 38.94,12.4 38.89,12.45
  Bottom 0.61: v14.48,35.43 14.48,29.72 22.1,22.05 28.07,22.05 arc-90 29.08,21.08 29.08,20.32 arc90 29.72,19.68 34.79,19.68 arc90 34.8,19.68 35.55,19.68 arc-95 37.84,20.44 arc-58 38.89,18.03 38.89,12.45 38.89,8.73 40.01,7.62 48.9,7.62 49.28,7.67
  Bottom 0.762: v48.9,7.67 49.28,7.67 v49.78,7.67
V_USB  (via drill 0.3, 0.41, 0.46)
  Top 0.254: 46.48,10.9 46.79,10.85 v46.86,10.62 | R3.2 55.93,9.89 v55.65,9.61 | R11.2 56.22,11.17 56.09,11.05 | 55.65,10.39 55.99,10.39 56.09,10.29
  Top 0.457: C2.2 56.22,8.07 C3.2
  Top 0.61: 28.96,36.96 arc90 27.43,35.56 J1.A9-VBUS | J1.B9-VBUS 30.47,35.57 arc90 28.96,36.96 | 28.95,36.96 28.96,36.96 | U1.8 46.48,10.9 | Q1.1 54.79,9.61 v55.65,9.61 | D3.A 56.09,11.05 56.09,10.29 56.09,8.54 C3.2
  Top 0.66: v29.46,30.73 v28.45,30.73 28.95,30.73 GBP_JACK.VCC
  Top 0.711: v45.09,22.61 v45.72,22.61
  Top 0.762: v28.95,37.34 28.95,36.96 | v55.65,9.61 v55.65,10.37 55.65,10.39 | v46.86,10.62 v46.86,11.38
  Top 0.813: v28.95,37.34 v28.95,36.58
  Bottom 0.254: GBP_JACK.VCC 28.81,29.97 27.43,29.97 arc90 27.05,29.59 27.05,24.38 arc90 27.69,23.75 40.39,23.75 arc-90 40.89,23.24 40.89,22.21 41.01,22.09 | v45.09,22.61 45.09,22.86
  Bottom 0.61: U$54.P$1 46.17,22.86 45.09,22.86 41.78,22.86 arc90 41.01,22.09 41.01,12.83 arc90 41.53,12.32 46.86,12.32 | 46.86,12.32 49.39,12.32 52.1,9.61 v55.65,9.61 | v46.86,11.38 46.86,12.32
  Bottom 0.711: v45.09,22.61 v45.72,22.61
  Bottom 0.762: 55.65,10.39 v55.65,10.37 v55.65,9.61 | v46.86,11.38 v46.86,10.62
  Bottom 0.813: GBP_JACK.VCC v28.95,37.34
VCC  (via drill 0.3, 0.36, 0.41)
  Top 0.254: Q1.2 53.85,8.51 54.28,8.51 v55.17,7.62 | 49.09,16.69 v49.72,16.7
  Top 0.457: C6.1 52.67,10.89
  Top 0.61: Q1.2 arc-42 52.67,10.07 52.67,10.89 52.67,12.57 D3.C | 49.78,16.69 49.09,16.69 48.86,16.69
  Top 0.762: v53.59,13.16 v53.59,12.39 53.59,12.57 D3.C
  Bottom 0.254: PP4.P$1 arc90 PP4.P$1 65.66,28.32 arc-90 67.18,26.8 67.18,25.02 arc90 67.82,24.38 73.66,24.38 arc-90 76.2,21.84 76.2,15.11 arc-90 74.17,13.06 71.12,13.06 arc90 70.74,12.7 70.74,11.94 arc-90 70.73,11.93 70.73,9.84 68.33,7.43 55.31,7.43 v55.17,7.62
  Bottom 0.61: v53.59,13.16 51.31,15.24 49.91,15.24 arc-90 48.74,16.36 48.74,16.69 | 48.74,16.69 U$1.P$1 | v49.72,16.7 arc-90 49.66,16.69 48.74,16.69
  Bottom 0.762: v53.59,12.39 v53.59,13.16
VIN  (via drill 0.3, 0.41)
  Top 0.508: 66.67,8 66.44,7.64 U2.4 | U2.5 66.63,8.59 66.67,8.64 | C7.2 66.66,11.32 66.67,11.3
  Top 0.61: v66.67,14.86 65.98,14.86 L2.P$1 | v66.67,14.1 66.67,11.3 66.67,8.64 66.67,8 | v68.33,16.57 68.67,16.57 J3.1
  Top 0.762: v66.67,14.1 v66.67,14.86 | v68.96,16.57 v68.33,16.57
  Bottom 0.254: 63.3,25.78 PP3.P$1 | PP3.P$1 PP3.P$1 arc-90 PP3.P$1 | PP3.P$1 arc61 64.64,24.51 65.27,24.51 arc-50 65.78,24.13 arc60 67.43,22.86 73.53,22.86 arc-90 74.67,21.71 74.67,15.11 arc-90 74.05,14.49 70.97,14.49 arc-90 70.73,14.73 70.73,15.62 J3.1
  Bottom 0.61: J3.1 68.67,17.49 66.67,15.49 v66.67,14.86
  Bottom 0.762: v66.67,14.86 v66.67,14.1 | v68.33,16.57 v68.96,16.57

### Text on the board
tPlace: USB | BATTERY CHARGER | BOOST CONVERTER | SAFE CHARGE-PLAY | AUDIO AMPLIFIER | 5V | V3.2 | 2023/10 | 5V | SJ1 | S | +SP- | C | D
bPlace: GUIDE: HTTPS://SHOP.GILTESA.COM/?P=446 | GND | BATIN | READ THE GUIDE FOR A | SUCCESSFUL INSTALLATION | SDN | VOUT | GB+5V | VIN | V3.2 | GND | 2023/10